# Altium schematic sheet MainPDU_13VBuck.SchDoc
size B
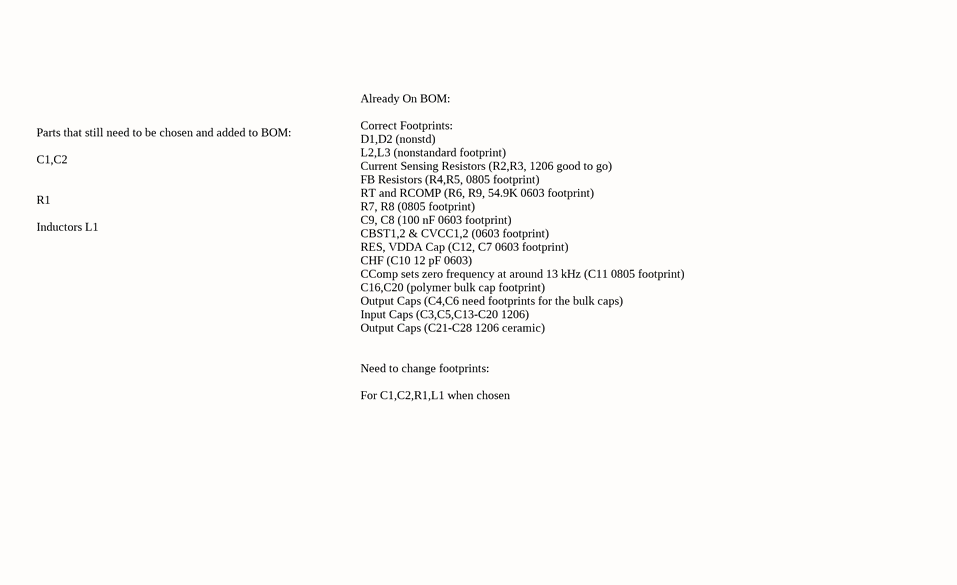
[diagram p0: MainPDU_13VBuck.SchDoc, left]
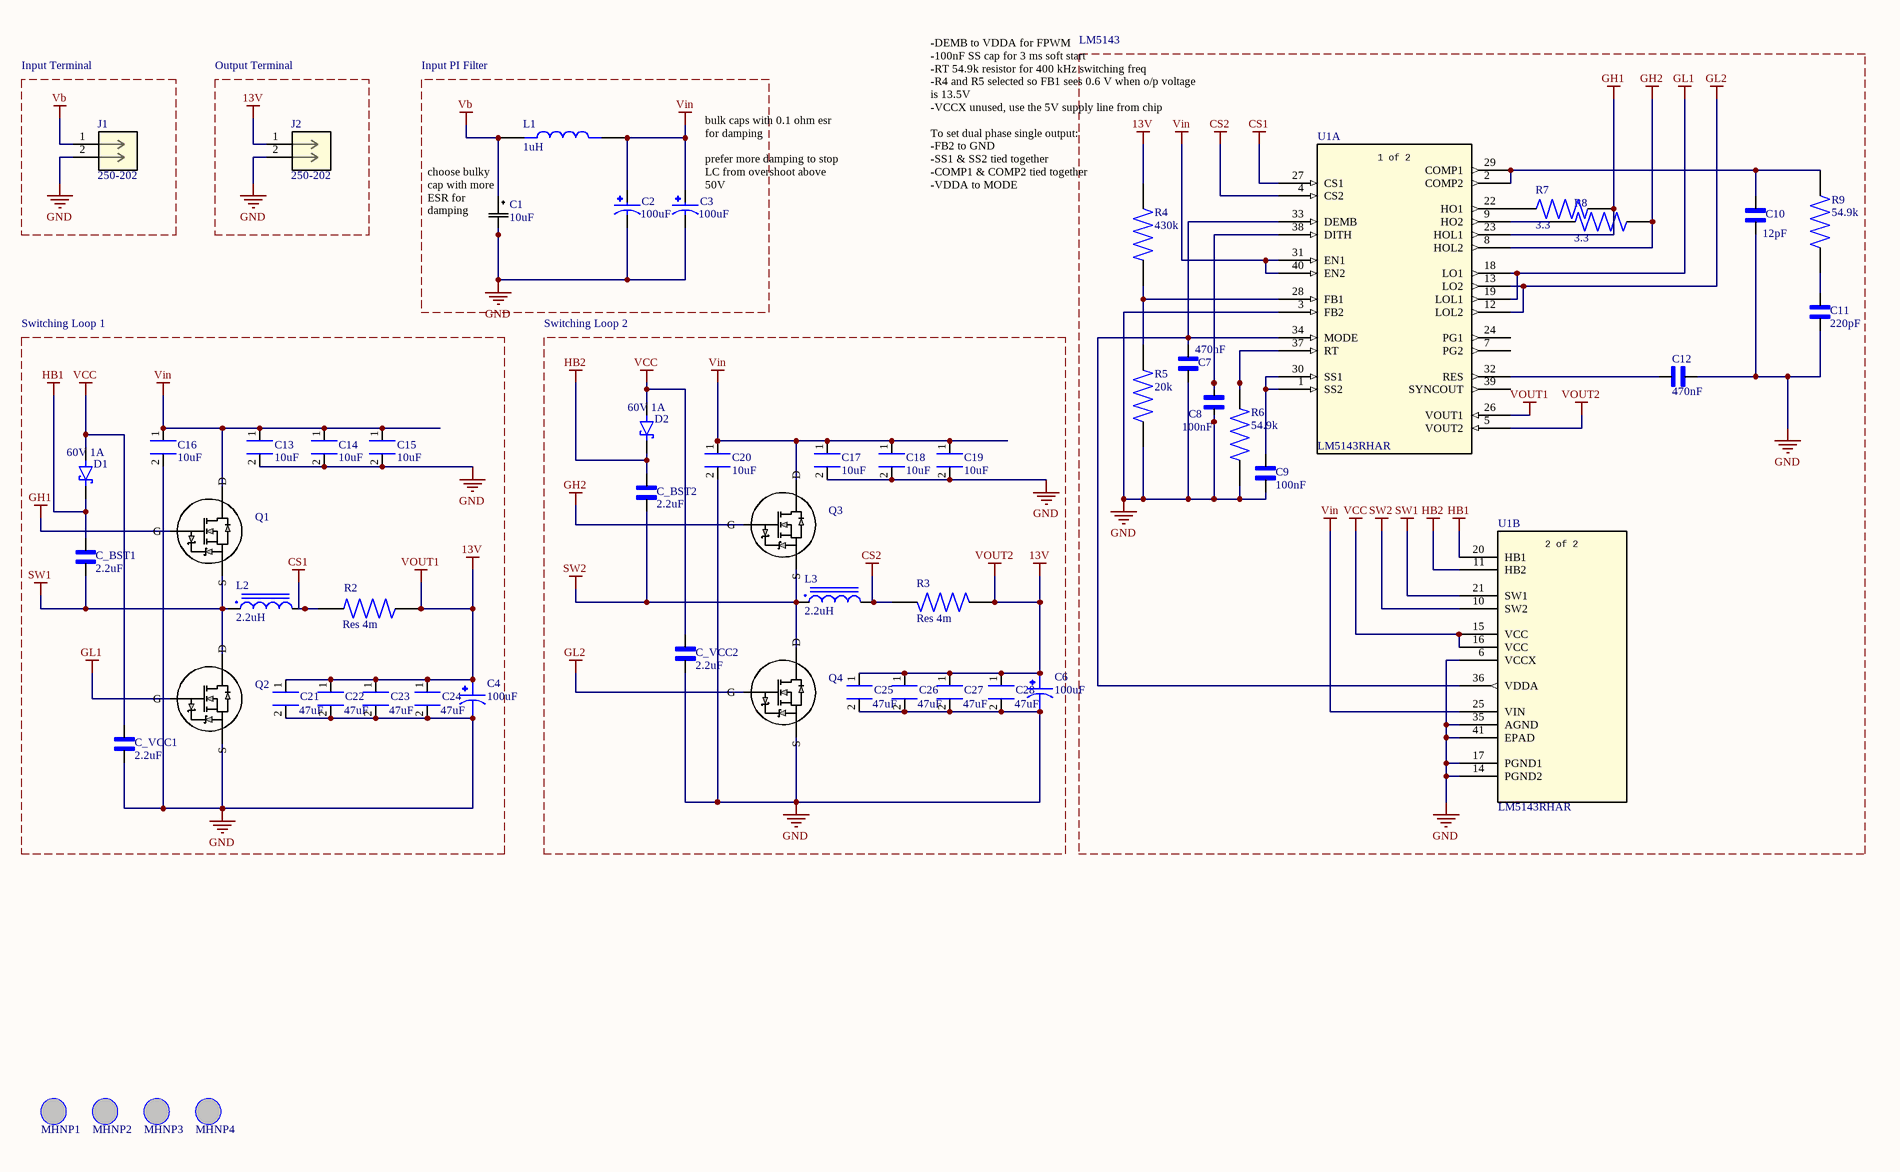
[diagram p1: MainPDU_13VBuck.SchDoc, right]

## Parts
C1  10uF  [CAP_GY_6P3X5P8_NCH]
C2  100uF  [CAP_YX_10X20_RUB]
C3  100uF  [CAP_YX_10X20_RUB]
C4  100uF  [CAPAE660X600N]
C6  100uF  [CAPAE660X600N]
C7  470nF  [CAPC1608X90N]
C8  100nF  [CAPC1608X90N]
C9  100nF  [CAPC1608X90N]
C10  12pF  [CAPC1608X90N]
C11  220pF  [CAPC2012X75N]
C12  470nF  [CAPC1608X90N]
C13  10uF  [Cap 1206]
C14  10uF  [Cap 1206]
C15  10uF  [Cap 1206]
C16  10uF  [Cap 1206]
C17  10uF  [Cap 1206]
C18  10uF  [Cap 1206]
C19  10uF  [Cap 1206]
C20  10uF  [Cap 1206]
C21  47uF  [Cap 1206]
C22  47uF  [Cap 1206]
C23  47uF  [Cap 1206]
C24  47uF  [Cap 1206]
C25  47uF  [Cap 1206]
C26  47uF  [Cap 1206]
C27  47uF  [Cap 1206]
C28  47uF  [Cap 1206]
C_BST1  2.2uF  [CAPC1608X90N]
C_BST2  2.2uF  [CAPC1608X90N]
C_VCC1  2.2uF  [CAPC1608X90N]
C_VCC2  2.2uF  [CAPC1608X90N]
D1  60V 1A  [DIO_RB051MM_ROM]
D2  60V 1A  [DIO_RB051MM_ROM]
J1  250-202  [CONN2_250-202_WAG]
J2  250-202  [CONN2_250-202_WAG]
L1  1uH  [IND_SPM4030T-1R0M]
L2  2.2uH  [IND_SRU1048-2R2Y]
L3  2.2uH  [IND_SRU1048-2R2Y]
MHNP1  Mounting Hole Non-Plated 3.2 mm  [MTHNP3P2MM]  (value not drawn)
MHNP2  Mounting Hole Non-Plated 3.2 mm  [MTHNP3P2MM]  (value not drawn)
MHNP3  Mounting Hole Non-Plated 3.2 mm  [MTHNP3P2MM]  (value not drawn)
MHNP4  Mounting Hole Non-Plated 3.2 mm  [MTHNP3P2MM]  (value not drawn)
Q1  IRFZ44N,127  [SOT78_TO220_NXP]  (value not drawn)
Q2  IRFZ44N,127  [SOT78_TO220_NXP]  (value not drawn)
Q3  IRFZ44N,127  [SOT78_TO220_NXP]  (value not drawn)
Q4  IRFZ44N,127  [SOT78_TO220_NXP]  (value not drawn)
R2  Res 4m  [Res 1206]
R3  Res 4m  [Res 1206]
R4  430k  [RES0805]
R5  20k  [RES0805]
R6  54.9k  [RES_ERJ3EKF5492V]
R7  3.3  [RES0805]
R8  3.3  [RES0805]
R9  54.9k  [RES_ERJ3EKF5492V]
U1  LM5143RHAR  [VQFN40_RHA_TEX-L]  (parts A,B of 2)

## Blocks framed on the sheet
Input Terminal: J1
Output Terminal: J2
Input PI Filter: C1-C3 L1
LM5143: C7-C12 R4-R9 U1
Switching Loop 1: C4 C13-C16 C21-C24 C_BST1 C_VCC1 D1 L2 Q1 Q2 R2
Switching Loop 2: C6 C17-C20 C25-C28 C_BST2 C_VCC2 D2 L3 Q3 Q4 R3

## Nets
13V: C4.1 C6.1 C21.1 C22.1 C23.1 C24.1 C25.1 C26.1 C27.1 C28.1 J2.1 R2.2 R3.1 R4.1 U1.5(VOUT2) U1.26(VOUT1)  [also labelled VOUT1, VOUT2]
CS1: L2.2 R2.1 U1.27(CS1)
CS2: L3.2 R3.2 U1.4(CS2)
GH1: Q1.1(G) R7.2 U1.23(HOL1)
GH2: Q3.1(G) R8.2 U1.8(HOL2)
GL1: Q2.1(G) U1.18(LO1) U1.19(LOL1)
GL2: Q4.1(G) U1.12(LOL2) U1.13(LO2)
GND: C1.2 C2.2 C3.2 C4.2 C6.2 C7.1 C8.1 C9.1 C10.1 C11.1 C12.1 C13.2 C14.2 C15.2 C16.2 C17.2 C18.2 C19.2 C20.2 C21.2 C22.2 C23.2 C24.2 C25.2 C26.2 C27.2 C28.2 C_VCC1.1 C_VCC2.1 J1.2 J2.2 Q2.3(S) Q4.3(S) R5.2 R6.2 U1.3(FB2) U1.6(VCCX) U1.14(PGND2) U1.17(PGND1) U1.35(AGND) U1.41(EPAD)
HB1: C_BST1.2 D1.1(C) U1.20(HB1)
HB2: C_BST2.2 D2.1(C) U1.11(HB2)
SW1: C_BST1.1 L2.1 Q1.3(S) Q2.2(D) U1.21(SW1)
SW2: C_BST2.1 L3.1 Q3.3(S) Q4.2(D) U1.10(SW2)
Vb: C1.1 J1.1 L1.1
VCC: C_VCC1.2 C_VCC2.2 D1.2(A) D2.2(A) U1.15(VCC) U1.16(VCC)
Vin: C2.1 C3.1 C13.1 C14.1 C15.1 C16.1 C17.1 C18.1 C19.1 C20.1 L1.2 Q1.2(D) Q3.2(D) U1.25(VIN) U1.31(EN1) U1.40(EN2)
NetC7_2: C7.2 U1.33(DEMB) U1.34(MODE) U1.36(VDDA)
NetC8_2: C8.2 U1.38(DITH)
NetC9_2: C9.2 U1.1(SS2) U1.30(SS1)
NetC10_2: C10.2 R9.1 U1.2(COMP2) U1.29(COMP1)
NetC11_2: C11.2 R9.2
NetC12_2: C12.2 U1.32(RES)
NetR4_2: R4.2 R5.1 U1.28(FB1)
NetR6_1: R6.1 U1.37(RT)
NetR7_1: R7.1 U1.22(HO1)
NetR8_1: R8.1 U1.9(HO2)

Not connected (* = marked no-connect by the designer): U1 7(PG2) 24(PG1) 39(SYNCOUT)

## Notes on the sheet
- (near C3) bulk caps with 0.1 ohm esr for damping
  prefer more damping to stop LC from overshoot above 50V
- (near R4) -DEMB to VDDA for FPWM
  -100nF SS cap for 3 ms soft start
  -RT 54.9k resistor for 400 kHz switching freq
  -R4 and R5 selected so FB1 sees 0.6 V when o/p voltage is 13.5V
  -VCCX unused, use the 5V supply line from chip
  To set dual phase single output:
  -FB2 to GND
  -SS1 & SS2 tied together
  -COMP1 & COMP2 tied together
  -VDDA to MODE
- (near C1) choose bulky cap with more ESR for damping
- Parts that still need to be chosen and added to BOM:
  C1,C2
  R1
  Inductors L1
- Already On BOM:
  Correct Footprints:
  D1,D2 (nonstd)
  L2,L3 (nonstandard footprint)
  Current Sensing Resistors (R2,R3, 1206 good to go)
  FB Resistors (R4,R5, 0805 footprint)
  RT and RCOMP (R6, R9, 54.9K 0603 footprint)
  R7, R8 (0805 footprint)
  C9, C8 (100 nF 0603 footprint)
  CBST1,2 & CVCC1,2 (0603 footprint)
  RES, VDDA Cap (C12, C7 0603 footprint)
  CHF (C10 12 pF 0603)
  CComp sets zero frequency at around 13 kHz (C11 0805 footprint)
  C16,C20 (polymer bulk cap footprint)
  Output Caps (C4,C6 need footprints for the bulk caps)
  Input Caps (C3,C5,C13-C20 1206)
  Output Caps (C21-C28 1206 ceramic)
  Need to change footprints:
  For C1,C2,R1,L1 when chosen
- (in symbol LM5143RHAR_1, part A) 1 of 2
- (in symbol LM5143RHAR_1, part B) 2 of 2

## Library data of the parts
C1 = GYA1J100MCQ1GS: Description; Manufacturer_Name: Nichicon; Copyright: Copyright (C) 2026 Ultra Librarian. All rights reserved.; Manufacturer_Part_Number: GYA1J100MCQ1GS
C2 C3 = 100ZLH100MEFC10X20: Description; Manufacturer_Name: Rubycon; Copyright: Copyright (C) 2025 Ultra Librarian. All rights reserved.; Manufacturer_Part_Number: 100ZLH100MEFC10X20
C4 C6 = A768EB107M1ELAS036: 100 ÂµF 25 V Aluminum - Polymer Capacitors Radial, Can - SMD 36mOhm 2000 Hrs @ 125Â°C; MF: KEMET; SnapEDA_Link: https://www.snapeda.com/parts/A768EB107M1ELAS036/Kemet/view-part/?ref=snap; Package: None; Value: *; MP: A768EB107M1ELAS036; Check_prices: https://www.snapeda.com/parts/A768EB107M1ELAS036/Kemet/view-part/?ref=eda
C7-C10 C12 C_BST1 C_BST2 C_VCC1 C_VCC2 = CL10B474KA8NFNC: 0.47 ÂµF Â±10% 25V Ceramic Capacitor X7R 0603 (1608 Metric); MF: Samsung Electro-Mechanics; SnapEDA_Link: https://www.snapeda.com/parts/CL10B474KA8NFNC/Samsung/view-part/?ref=snap; Package: SMD-2 Samsung; Value: *; MP: CL10B474KA8NFNC; Check_prices: https://www.snapeda.com/parts/CL10B474KA8NFNC/Samsung/view-part/?ref=eda
C11 = CL21C221JBANNNC: 0805 (2012 Metric) 220 pF Â±5% 50V Ceramic Capacitor C0G, NP0; MF: Samsung; SnapEDA_Link: https://www.snapeda.com/parts/CL21C221JBANNNC/Samsung/view-part/?ref=snap; Package: SMD-2 Samsung; Value: *; MP: CL21C221JBANNNC; Check_prices: https://www.snapeda.com/parts/CL21C221JBANNNC/Samsung/view-part/?ref=eda
C13-C28 = Cap 1206: Generic SMD capacitor with 1206 package (3216 metric)
D1 D2 = RBR1MM60ATR: DIODE SCHOTTKY 60V 1A PMDU; MP: IDK05G120C5XTMA1; MF: Infineon Technologies; Package: TO-263-3 Infineon Technologies; SnapEDA_Link: https://www.snapeda.com/parts/IDK05G120C5XTMA1/Infineon%20Technologies/view-part/4703675/?ref=snap; Value: *; Availability: In Stock; Price: None; Check_prices: https://www.snapeda.com/parts/IDK05G120C5XTMA1/Infineon%20Technologies/view-part/4703675/?ref=eda
J1 J2 = 250-202: Description; Manufacturer_Name: Wago; Copyright: Copyright (C) 2025 Ultra Librarian. All rights reserved.; Manufacturer_Part_Number: 250-202; RefDes: RefDes; Type: Type
L1 = SPM4030T-1R0M: MF: {'manufacturer': u'TDK Corporation'}; Package: None; Price: None; Value: *; MP: SPM4030T-1R0M; Availability: Unavailable
L2 L3 = SRU1048-2R2Y: Ind10x10x4.8mm,2.2uH30%6.5A,shdSMD | Bourns SRU1048-2R2Y; SnapEDA_Link: https://www.snapeda.com/parts/SRU1048-2R2Y/Bourns/view-part/?ref=snap; Package: Non Standard Bourns; Value: *; MF: Bourns; MP: SRU1048-2R2Y; Check_prices: https://www.snapeda.com/parts/SRU1048-2R2Y/Bourns/view-part/?ref=eda
MHNP1-MHNP4 = MTHNP3P2MM
Q1-Q4 = IRFZ44N,127: Power Switching Mosfet; Manufacturer_Name: NXP; Copyright: Copyright (C) 2025 Ultra Librarian. All rights reserved.; Manufacturer_Part_Number: IRFZ44N,127; RefDes: RefDes; Type: Type
R2 R3 = Res 1206: Generic SMD resistor with 1206 package (3216 metric)
R4 R5 R7 R8 = RC0805FR-07430KL: Generic 0805 Res; Original: 430 kOhms Â±1% 0.125W, 1/8W Chip Resistor 0805 (2012 Metric) Moisture Resistant Thick Film RC0805FR-07430KL; MF: Yageo; SnapEDA_Link: https://www.snapeda.com/parts/RC0805FR-07430KL/Yageo/view-part/?ref=snap; Package: 2012 Yageo; Value: *; MP: RC0805FR-07430KL; Check_prices: https://www.snapeda.com/parts/RC0805FR-07430KL/Yageo/view-part/?ref=eda
R6 R9 = ERJ3EKF5492V: Res Thick Film 0603 54.9K Ohm 1% 1/10W Â±100ppm/Â°C Molded SMD SMD Punched Carrier T/R; MF: Panasonic; SnapEDA_Link: https://www.snapeda.com/parts/ERJ3EKF5492V/Panasonic/view-part/?ref=snap; Package: 1608-2 Panasonic; Value: *; MP: ERJ3EKF5492V; Check_prices: https://www.snapeda.com/parts/ERJ3EKF5492V/Panasonic/view-part/?ref=eda
U1 = LM5143RHAR_1: 3.5-V to 65-V, dual-output, stackable, synchronous buck DC/DC controller with ultra-low IQ 40-VQFN -40 to 150; Manufacturer_Name: Texas Instruments; Copyright: Copyright (C) 2026 Ultra Librarian. All rights reserved.; Manufacturer_Part_Number: LM5143RHAR; RefDes: RefDes; Type: Type